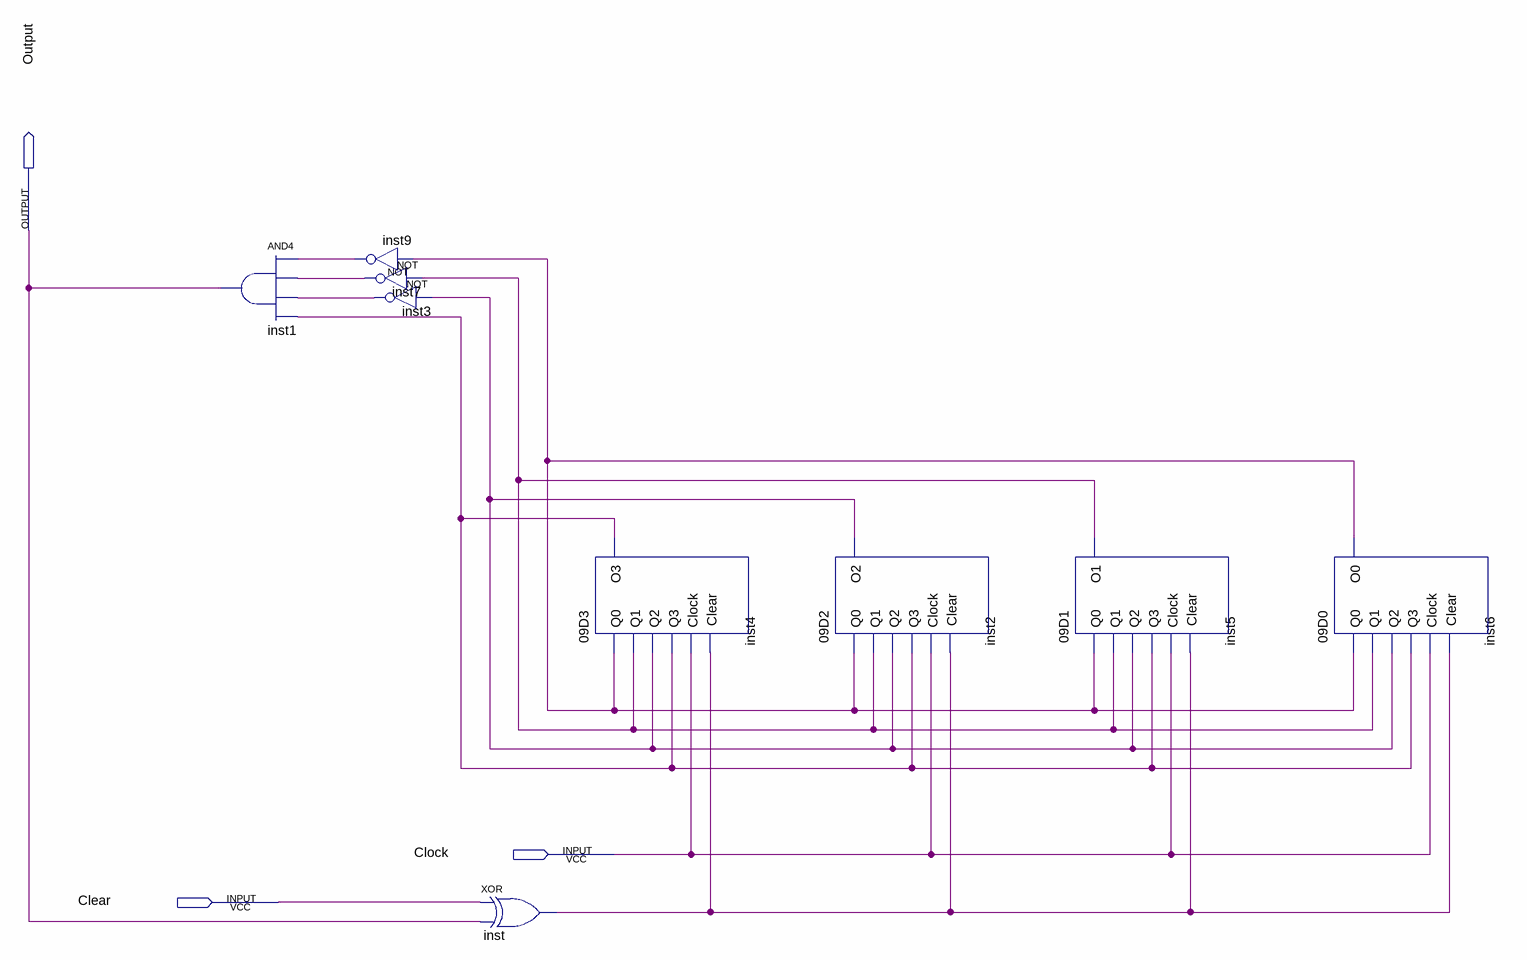
[diagram p0: schematic sheet]
// Quartus schematic Contador09.bdf as structural Verilog: 9 symbols, 3 pins
module Contador09 (
  input  Clock,
  input  Clear,
  output Output
);

  wire inst2_o2, inst3_out, inst4_o3, inst5_o1, inst6_o0, inst7_out, inst9_out, inst_out;

  and inst1 (Output, inst9_out, inst7_out, inst3_out, inst4_o3);
  not inst9 (inst9_out, inst6_o0);
  not inst7 (inst7_out, inst5_o1);
  not inst3 (inst3_out, inst2_o2);
  xor inst (inst_out, Clear, Output);
  \09D3  inst4 (
    .Q0(inst6_o0), .Q1(inst5_o1), .Q2(inst2_o2), .Q3(inst4_o3), .Clock(Clock), .Clear(inst_out), .O3(inst4_o3));
  \09D2  inst2 (
    .Q0(inst6_o0), .Q1(inst5_o1), .Q2(inst2_o2), .Q3(inst4_o3), .Clock(Clock), .Clear(inst_out), .O2(inst2_o2));
  \09D1  inst5 (
    .Q0(inst6_o0), .Q1(inst5_o1), .Q2(inst2_o2), .Q3(inst4_o3), .Clock(Clock), .Clear(inst_out), .O1(inst5_o1));
  \09D0  inst6 (
    .Q0(inst6_o0), .Q1(inst5_o1), .Q2(inst2_o2), .Q3(inst4_o3), .Clock(Clock), .Clear(inst_out), .O0(inst6_o0));
endmodule
